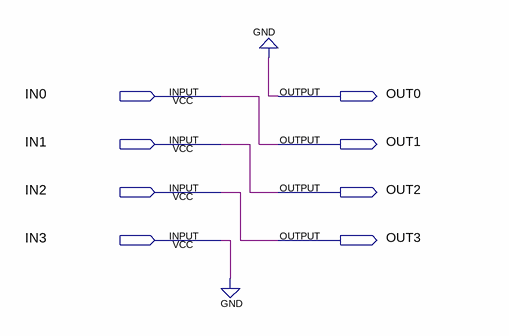
[diagram p0: schematic sheet]
// Quartus schematic iwanttodie.bdf as structural Verilog: 0 symbols, 8 pins
module iwanttodie (
  input  IN0,
  input  IN1,
  input  IN2,
  input  IN3,
  output OUT0,
  output OUT1,
  output OUT2,
  output OUT3
);


  assign OUT0 = 1'b0;
  assign OUT1 = IN0;
  assign OUT2 = IN1;
  assign OUT3 = IN2;
  // also tied to GND on the sheet: IN3
endmodule
